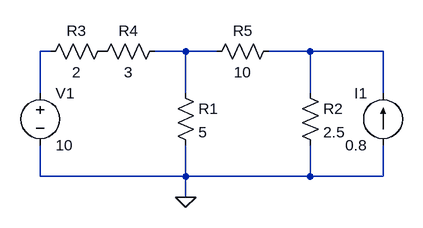
[diagram p0: schematic Circuit_1.asc]
Circuit_1.asc, the LTspice schematic file:
Version 4.1
SHEET 1 880 680
WIRE -96 48 -112 48
WIRE 112 48 64 48
WIRE 160 48 112 48
WIRE 304 48 240 48
WIRE 416 48 304 48
WIRE -112 112 -112 48
WIRE 112 112 112 48
WIRE 304 112 304 48
WIRE 416 112 416 48
WIRE -112 240 -112 192
WIRE 112 240 112 192
WIRE 112 240 -112 240
WIRE 304 240 304 192
WIRE 304 240 112 240
WIRE 416 240 416 192
WIRE 416 240 304 240
WIRE 112 272 112 240
FLAG 112 272 0
SYMBOL voltage -112 96 R0
WINDOW 123 0 0 Left 0
WINDOW 39 0 0 Left 0
SYMATTR InstName V1
SYMATTR Value 10
SYMBOL res 96 96 R0
SYMATTR InstName R1
SYMATTR Value 5
SYMBOL res 288 96 R0
SYMATTR InstName R2
SYMATTR Value 2.5
SYMBOL res 0 32 R90
WINDOW 0 0 56 VBottom 2
WINDOW 3 32 56 VTop 2
SYMATTR InstName R3
SYMATTR Value 2
SYMBOL res 80 32 R90
WINDOW 0 0 56 VBottom 2
WINDOW 3 32 56 VTop 2
SYMATTR InstName R4
SYMATTR Value 3
SYMBOL current 416 192 R180
WINDOW 0 24 80 Left 2
WINDOW 3 24 0 Left 2
WINDOW 123 0 0 Left 0
WINDOW 39 0 0 Left 0
SYMATTR InstName I1
SYMATTR Value 0.8
SYMBOL res 256 32 R90
WINDOW 0 0 56 VBottom 2
WINDOW 3 32 56 VTop 2
SYMATTR InstName R5
SYMATTR Value 10

The netlist it stands for:
* Circuit_1.asc
V1 N001 0 10
R1 N002 0 5
R2 N003 0 2.5
R3 P001 N001 2
R4 N002 P001 3
I1 0 N003 0.8
R5 N003 N002 10
.backanno
.end